# EAGLE design Temperatura y humedadALIM (EAGLE 7.6.0)
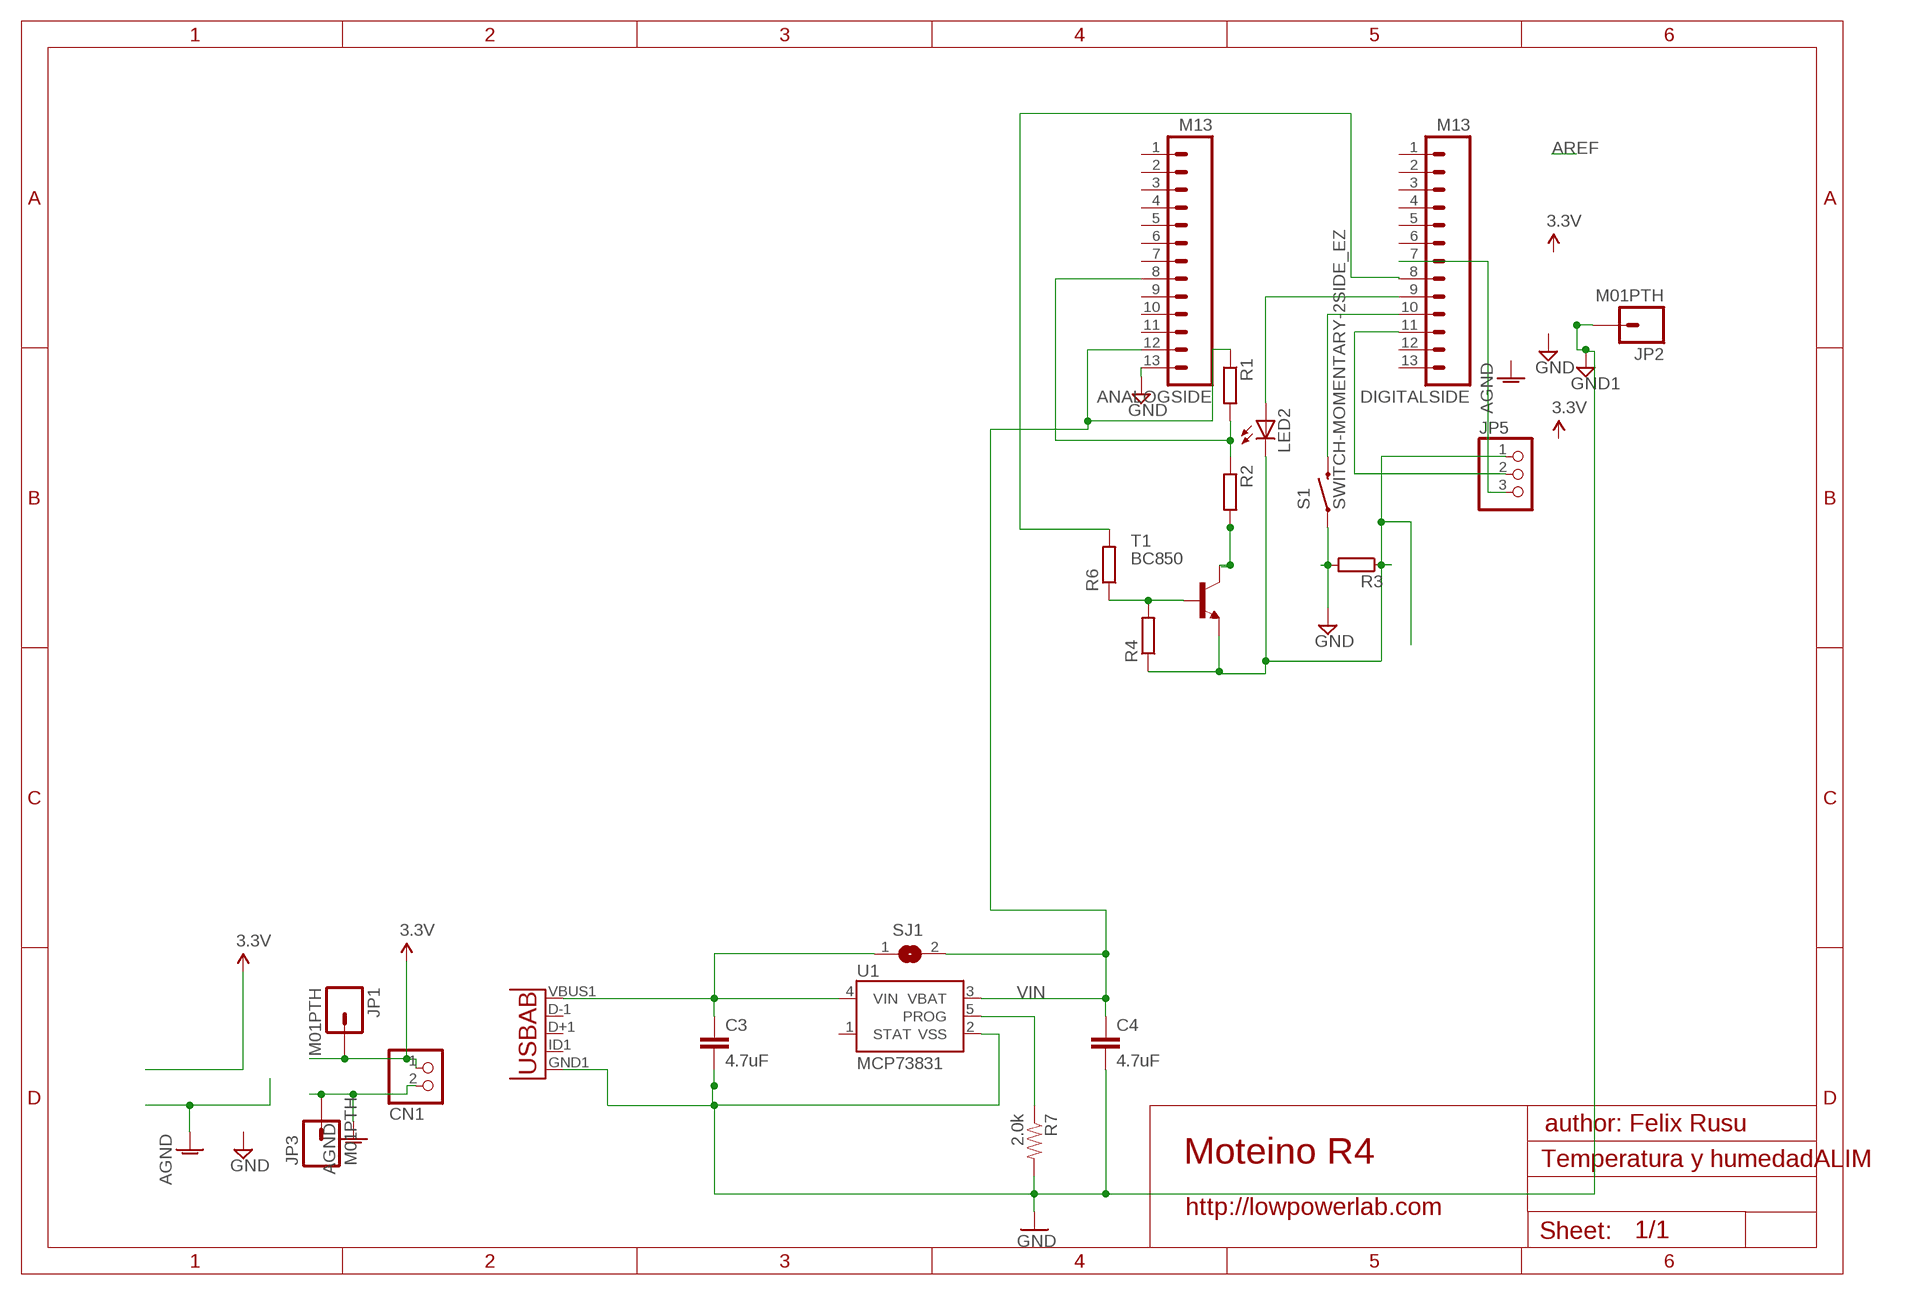
[diagram p0: schematic, sheet 1]

## Parts
ANALOGSIDE  M13  [1X13]
C3  4.7uF  4.7UF-6.3V-10%(0603)0603  [0603-CAP]
C4  4.7uF  4.7UF-6.3V-10%(0603)0603  [0603-CAP]
CN1  JST_2PIN-SMT  [JST-PH-2-SMT]
DIGITALSIDE  M13  [1X13]
JP1  M01PTH  [1X01]
JP2  M01PTH  [1X01]
JP3  M01PTH  [1X01]
JP5  PINHD-1X3  [1X03]
JP9  Micro USB  USB-ABCONN-11794  [USB-AB-MICRO-SMD_V03]
LED2  LED3MM  [LED3MM]
R1  R-EU_0204/7  [0204/7]
R2  R-EU_0204/7  [0204/7]
R3  R-EU_M1206  [M1206]
R4  R-EU_M1206  [M1206]
R6  R-EU_M1206  [M1206]
R7  2.0k  2.0KOHM1/10W5%(0603)  [0603-RES]
S1  SWITCH-MOMENTARY-2SIDE_EZ  [TACTILE-PTH-SIDEEZ]
SJ1  SJ  [SJ]
T1  BC850  [SOT23]
U1  MCP73831  [SOT23-5]

## Nets
AGND [power]: CN1.2 JP3.1
GND [power]: ANALOGSIDE.13 R3.2 S1.1
GND1 [power]: C3.2 C4.2 JP2.1 JP9.GND1(GND) R7.2 U1.2(VSS) ; supply symbol labelled GND
N$1: DIGITALSIDE.10 S1.2
N$2: DIGITALSIDE.11 JP5.2
N$3: DIGITALSIDE.7 JP5.3
N$4 [power]: JP5.1 LED2.K(C) R3.1 R4.1 T1.2(E)
N$5: C3.1 JP9.VBUS1(VBUS) SJ1.1 U1.4(VIN)
N$6: ANALOGSIDE.8 R1.2 R2.1
N$7: R2.2 T1.3(C)
N$8: R4.2 R6.1 T1.1(B)
N$9: DIGITALSIDE.8 R6.2
N$10: DIGITALSIDE.9 LED2.A
PROG: R7.1 U1.5(PROG)
VCC: CN1.1 JP1.1 ; supply symbol labelled 3.3V
VIN: ANALOGSIDE.12 C4.1 R1.1 SJ1.2 U1.3(VBAT)
Unconnected: ANALOGSIDE.1 ANALOGSIDE.2 ANALOGSIDE.3 ANALOGSIDE.4 ANALOGSIDE.5 ANALOGSIDE.6 ANALOGSIDE.7 ANALOGSIDE.9 ANALOGSIDE.10 ANALOGSIDE.11 DIGITALSIDE.1 DIGITALSIDE.2 DIGITALSIDE.3 DIGITALSIDE.4 DIGITALSIDE.5 DIGITALSIDE.6 DIGITALSIDE.12 DIGITALSIDE.13 JP9.D+1(D+) JP9.D-1(D-) JP9.ID1(USBID) U1.1(STAT)

## Notes on the sheet
- author: Felix Rusu
- Moteino R4
- http://lowpowerlab.com

## Library data of the parts
ANALOGSIDE DIGITALSIDE = SparkFun-Connectors:M13: 13-pin single row .1" header
C3 C4 = SparkFun-Capacitors:4.7UF-6.3V-10%(0603): CAP-08280; PROD_ID: CAP-08280
CN1 = adafruit:JST_2PIN: JST 2-Pin Connectors of various flavors SMT-RA (S2B-PH-SM4) 4UConnector #17311 SMT (B2B-PH-SM4) THM-RA (S2B-PH) THM (B2B-PH)
JP1-JP3 = SparkFun-Connectors:M01: Header 1 Standard 1-pin 0.1" header. Use with straight break away headers (SKU : PRT-00116), right angle break away headers (PRT-00553), swiss pins (PRT-00743), machine pins (PRT-00117), and female headers (PRT-00115).
JP5 = pinhead:PINHD-1X3: PIN HEADER
JP9 = SparkFun-Connectors:USB-AB: This is a USB AB connector that is compatible with USB OTG. i.e. this connector can serve as a host or device; PROD_ID: CONN-11794
LED2 = led:LED: LED OSRAM: - CHIPLED LG R971, LG N971, LY N971, LG Q971, LY Q971, LO R971, LY R971 LH N974, LH R974 LS Q976, LO Q976, LY Q976 LO Q996 - Hyper CHIPLED LW Q18S LB Q993, LB Q99A, LB R99A - SideLED LS A670, LO A670, LY A670, LG A670, LP A670 LB A673, LV A673, LT A673, LW A673 LH A674 LY A675 LS A676, LA A676, LO A676, LY A676, LW A676 LS A679, LY A679, LG A679 - Hyper Micro SIDELED® LS Y876, LA Y876, LO Y876, LY Y876 LT Y87S - SmartLED LW L88C, LW L88S LB L89C, LB L89S, LG L890 LS L89K, LO L89K, LY L89K LS L896, LA L896, LO L896, LY L896 - TOPLED LS T670, LO T670, LY T670, LG T670, LP T670 LSG T670, LSP T670, LSY T670, LOP T670, LYG T670 LG T671, LOG T671, LSG T671 LB T673, LV T673, LT T673, LW T673 LH T674 LS T676, LA T676, LO T676, LY T676, LB T676, LH T676, LSB T676, LW T676 LB T67C, LV T67C, LT T67C, LS T67K, LO T67K, LY T67K, LW E67C LS E67B, LA E67B, LO E67B, LY E67B, LB E67C, LV E67C, LT E67C LW T67C LS T679, LY T679, LG T679 LS T770, LO T770, LY T770, LG T770, LP T770 LB T773, LV T773, LT T773, LW T773 LH T774 LS E675, LA E675, LY E675, LS T675 LS T776, LA T776, LO T776, LY T776, LB T776 LHGB T686 LT T68C, LB T68C - Hyper Mini TOPLED® LB M676 - Mini TOPLED Santana® LG M470 LS M47K, LO M47K, LY M47K Source: http://www.osram.convergy.de LUXEON: - LUMILED® LXK2-PW12-R00, LXK2-PW12-S00, LXK2-PW14-U00, LXK2-PW14-V00 LXK2-PM12-R00, LXK2-PM12-S00, LXK2-PM14-U00 LXK2-PE12-Q00, LXK2-PE12-R00, LXK2-PE12-S00, LXK2-PE14-T00, LXK2-PE14-U00 LXK2-PB12-K00, LXK2-PB12-L00, LXK2-PB12-M00, LXK2-PB14-N00, LXK2-PB14-P00, LXK2-PB14-Q00 LXK2-PR12-L00, LXK2-PR12-M00, LXK2-PR14-Q00, LXK2-PR14-R00 LXK2-PD12-Q00, LXK2-PD12-R00, LXK2-PD12-S00 LXK2-PH12-R00, LXK2-PH12-S00 LXK2-PL12-P00, LXK2-PL12-Q00, LXK2-PL12-R00 Source: www.luxeon.com KINGBRIGHT: KA-3528ASYC Source: www.kingbright.com
R1-R4 R6 = rcl:R-EU_: RESISTOR, European symbol
R7 = SparkFun-Resistors:2.0KOHM1/10W5%(0603): RES-08296; PROD_ID: RES-08296
S1 = SparkFun-Electromechanical:SWITCH-MOMENTARY-2: Various NO switches- pushbuttons, reed, etc
SJ1 = jumper:SJ: SMD solder JUMPER
T1 = transistor:BC850: NPN TRANSISTOR
U1 = SparkFun-PowerIC:MCP73831: Miniature single cell, fully integrated Li-Ion, Li-polymer charge management controller http://ww1.microchip.com/downloads/en/DeviceDoc/21984a.pdf IC-09995; PROD_ID: IC-09995

## Net classes
1 power: width 0.381 mm, clearance 0.254 mm

## Board
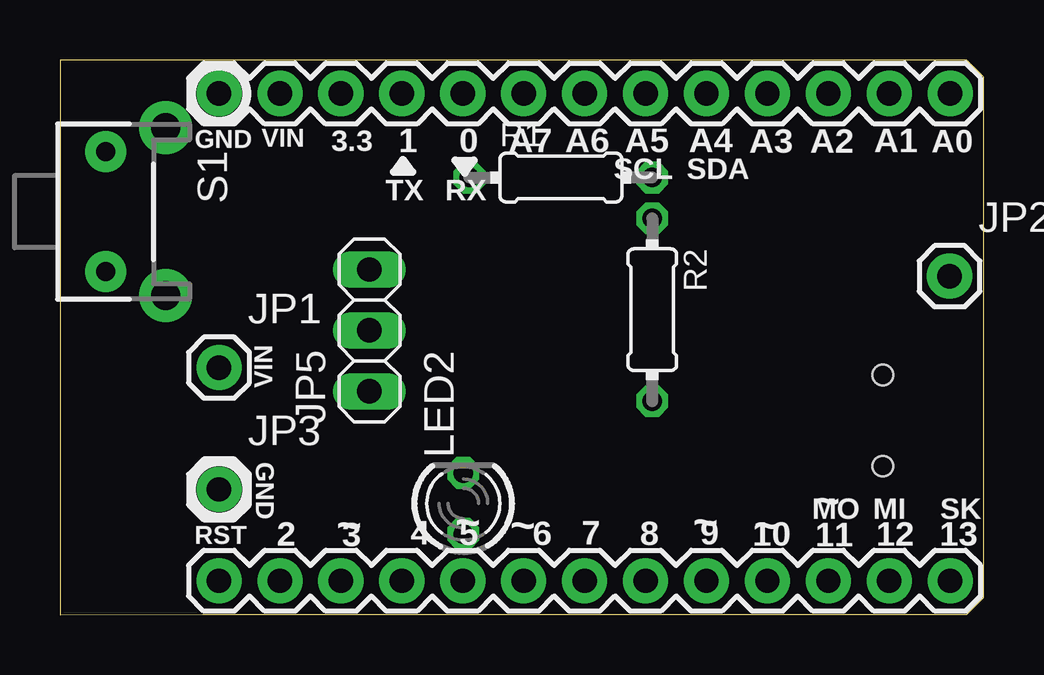
[diagram p1: board, top side]
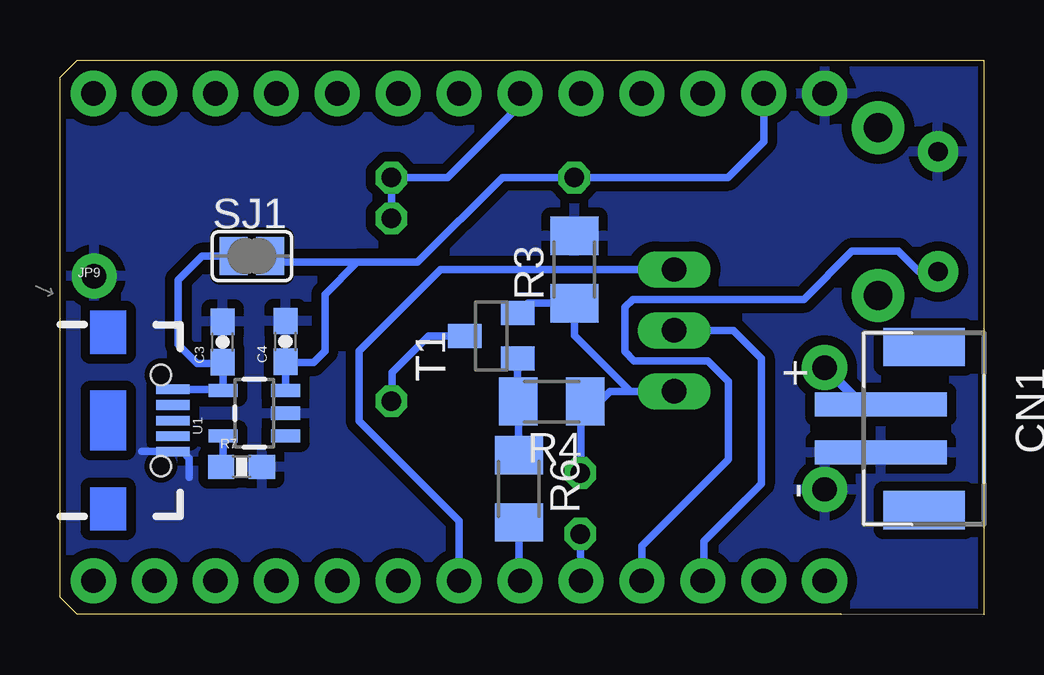
[diagram p2: board, bottom side, seen from below]

Size 38.51 x 23.14 mm. Coordinates in mm from the lower left corner, seen from the top.
Outline: 5.94,0.02 37.79,0.02 38.51,0.74 38.51,22.43 37.79,23.14 0,23.14 0,0 5.94,0.02
Copper layers (1*16): Top 0.035mm / dielectric 1.5mm / Bottom 0.035mm
Design rules "ITEADstudio_DRC *": minimum track width 6mil, minimum drill 12mil, track to track 16mil, track to pad 16mil, pad to pad 6mil, via to via 6mil, smd to smd 6mil, copper to edge 10mil, drill to drill 10mil, minimum pad ring 10mil, minimum via ring 6mil, stop-mask expansion 2mil, vias tented up to drill 100mil, thermal gap 15mil

### Footprints (pad centres in the part's own frame; a part is rotated, then mirrored left to right if it is on the bottom)
1X13 = drill 1.016 pad 1.88: 1 0,0; 2 2.54,0; 3 5.08,0; 4 7.62,0; 5 10.16,0; 6 12.7,0; 7 15.24,0; 8 17.78,0; 9 20.32,0; 10 22.86,0; 11 25.4,0; 12 27.94,0; 13 30.48,0
0603-CAP = smd 1.1 x 1: 1 -0.85,0; 2 0.85,0
JST-PH-2-SMT = smd 1 x 5.5: 1 -1,-1.8; 2 1,-1.8 | smd 1.6 x 3.4: NC1 -3.4,0; NC2 3.4,0
1X01 = drill 1.016 pad 1.88: 1 0,0
1X03 = drill 1.016 long: 1 -2.54,0; 2 0,0; 3 2.54,0
USB-AB-MICRO-SMD_V03 = smd 1.4 x 0.4: D+1 2.7,0; D-1 2.7,0.65; GND1 2.7,-1.3; ID1 2.7,-0.65; VBUS1 2.7,1.3 | hole 0.85: 2.2,1.9; 2.2,-1.9
LED3MM = drill 0.813 octagon: A -1.27,0; K 1.27,0
0204/7 = drill 0.813 octagon: 1 -3.81,0; 2 3.81,0
M1206 = smd 1.6 x 2: 1 -1.4,0; 2 1.4,0
0603-RES = smd 1.1 x 1: 1 -0.85,0; 2 0.85,0
TACTILE-PTH-SIDEEZ = drill 0.8 pad 1.7: 1 -2.5,0; 2 2.5,0 | drill 1.2 pad 2.2: ANCHOR1 -3.5,2.5; ANCHOR2 3.5,2.5
SJ = smd 1.168 x 1.6: 1 -0.762,0; 2 0.762,0
SOT23 = smd 1 x 1.4: 1 -0.95,-1.1; 2 0.95,-1.1; 3 0,1.1
SOT23-5 = smd 0.55 x 1.2: 1 -0.95,-1.3; 2 0,-1.3; 3 0.95,-1.3; 4 0.95,1.3; 5 -0.95,1.3

### Placement (x,y rotation side)
ANALOGSIDE  37.11,21.74 180 top
C3  31.72,11.38 90 bottom
C4  29.11,11.4 90 bottom
CN1  2.49,7.77 270 bottom
DIGITALSIDE  37.11,1.42 180 top
JP1  6.63,10.31 0 top
JP2  37.08,14.12 0 top
JP3  6.63,5.23 0 top
JP5  12.9,11.86 90 top
JP9  36.5,8.1 0 bottom
LED2  16.81,4.65 90 top
R1  20.88,18.24 0 top
R2  24.69,12.73 270 top
R3  17.07,14.4 90 bottom
R4  18.01,8.89 180 bottom
R6  19.38,5.26 270 bottom
R7  30.94,6.17 0 bottom
S1  1.91,16.81 270 top
SJ1  30.51,14.96 0 bottom
T1  20.52,11.63 90 bottom
U1  30.4,8.41 90 bottom

### Tracks (layer width: path | path; a pad name or v marks a point on that pad's centre or on a via)
AGND
  pour Bottom: 4.98,22.94 38.35,22.94 38.38,0.23 0.2,0.18 0.2,22.96
GND
  pour Bottom: 0.15,22.99 38.3,22.89 38.3,0.25 0.18,0.2
GND1
  Bottom 0.305: JP9.GND1 | JP9.GND1 35.1,6.81 | JP9.GND1 33.4,6.81 33.12,6.53 33.12,5.74
  pour Bottom: 0.2,22.96 38.35,22.91 38.35,0.15 0.2,0.2
N$1
  Bottom 0.305: S1.2 2.71,14.31 3.56,15.16 5.49,15.16 7.49,13.16 14.63,13.16 14.96,12.83 14.96,10.97 14.58,10.59 11.51,10.59 10.64,9.73 10.64,6.48 14.25,2.87 DIGITALSIDE.10
N$2
  Bottom 0.305: JP5.2 10.44,11.86 9.27,10.69 9.27,5.46 11.66,3.07 11.66,1.47 DIGITALSIDE.11
N$3
  Bottom 0.305: JP5.3 22.63,14.4 26.03,11 26.03,8.08 21.87,3.91 DIGITALSIDE.7 | 21.84,1.45 DIGITALSIDE.7 | 21.87,1.91 DIGITALSIDE.7
N$4
  Bottom 0.305: JP5.1 14.73,9.32 | 14.73,9.32 15.57,9.32 16.61,8.28 | LED2.K 16.79,5.94 16.79,8.1 16.61,8.28 | 14.73,9.32 17.07,11.66 R3.1 19,13 T1.2 | R4.1 16.61,8.28
N$5
  Bottom 0.305: JP9.VBUS1 31.75,9.4 U1.4 31.7,10.51 C3.1 31.76,10.49 32.79,10.49 33.58,11.28 33.58,13.97 32.59,14.96 SJ1.1
N$6
  Bottom 0.305: ANALOGSIDE.8 19.33,21.26 22.35,18.24 R1.2 R2.1
N$7
  Bottom 0.305: T1.3 23.14,11.63 24.66,10.11 24.66,8.94 R2.2
N$8
  Bottom 0.305: T1.1 R4.2 R6.1
N$9
  Bottom 0.305: R6.2 19.38,1.47 DIGITALSIDE.8
N$10
  Bottom 0.305: LED2.A DIGITALSIDE.9
PROG
  Bottom 0.305: U1.5 31.7,5.88 R7.1
VCC
  Bottom 0.406: CN1.1 5.09,8.77 JP1.1
VIN
  Bottom 0.305: U1.3 C4.1 29.07,10.52 27.94,10.52 27.46,11 27.46,13.36 26.11,14.71 | 26.11,14.71 25.86,14.71 23.6,14.71 20.07,18.24 R1.1 10.67,18.24 9.17,19.74 ANALOGSIDE.12 | SJ1.2 29.49,14.71 26.11,14.71

### Text on the board
_tsilk: GND | VIN | 3.3 | 1 | 0 | A7 | A6 | A5 | A4 | A3 | A2 | A1 | A0 | TX | RX | SCL | SDA | VIN | GND | 2 | 3 | 4 | 5 | 6 | 7 | 8 | 9 | 10 | MO | ~ | 11 | MI | 12 | SK | 13 | RST | ~ | ~ | ~ | ~ | ~